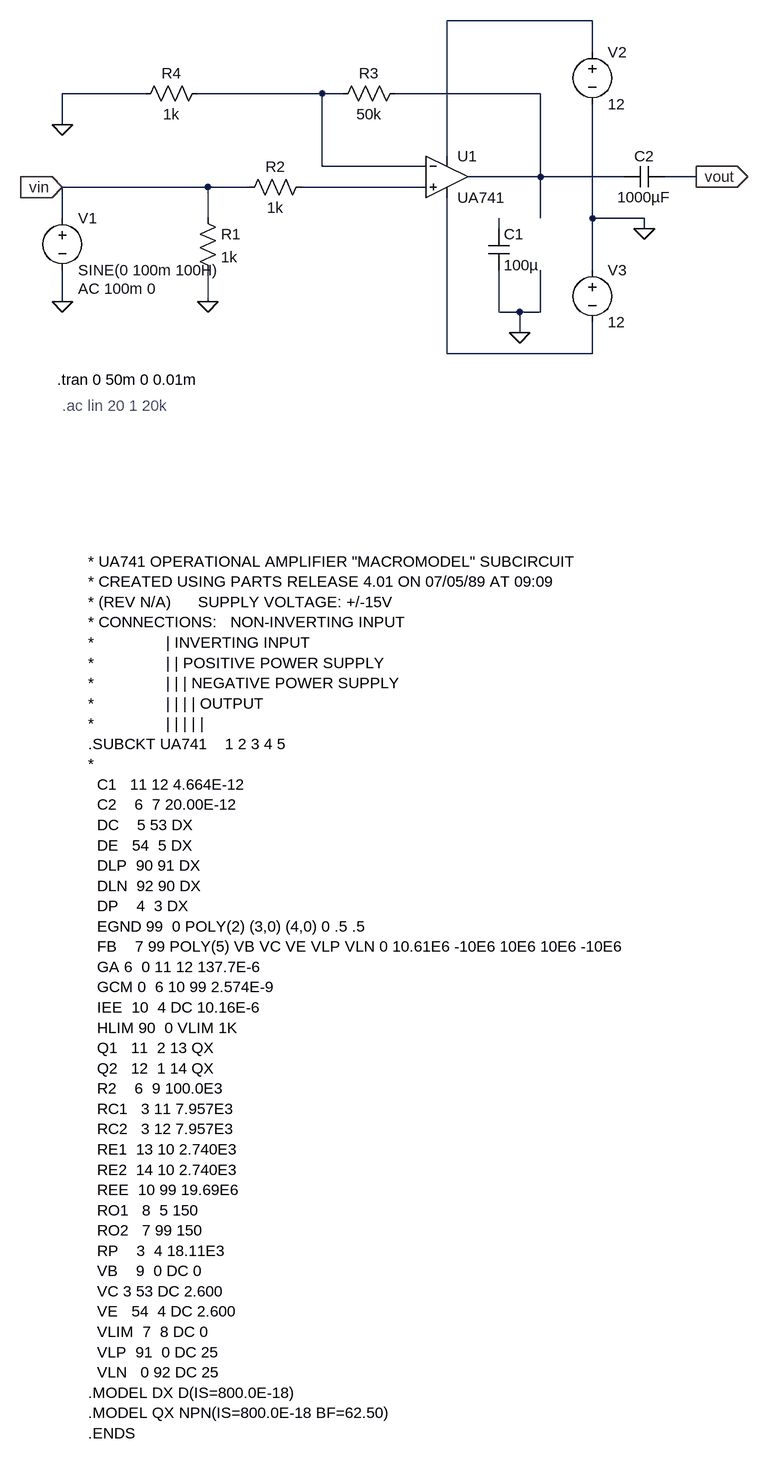
[diagram p0: schematic Speaker amplifier.asc]
Speaker amplifier.asc, the LTspice schematic file:
Version 4.1
SHEET 1 1136 1892
WIRE 864 -160 640 -160
WIRE 864 -112 864 -160
WIRE 176 -48 48 -48
WIRE 448 -48 256 -48
WIRE 480 -48 448 -48
WIRE 784 -48 560 -48
WIRE 48 0 48 -48
WIRE 640 48 640 -160
WIRE 448 64 448 -48
WIRE 608 64 448 64
WIRE 784 80 784 -48
WIRE 784 80 672 80
WIRE 912 80 784 80
WIRE 1024 80 976 80
WIRE 272 96 48 96
WIRE 336 96 272 96
WIRE 608 96 416 96
WIRE 48 144 48 96
WIRE 272 144 272 96
WIRE 784 144 784 80
WIRE 864 144 864 -32
WIRE 944 144 864 144
WIRE 720 160 720 144
WIRE 944 160 944 144
WIRE 864 224 864 144
WIRE 48 272 48 224
WIRE 272 272 272 224
WIRE 720 288 720 224
WIRE 752 288 720 288
WIRE 784 288 784 224
WIRE 784 288 752 288
WIRE 752 320 752 288
WIRE 640 352 640 112
WIRE 864 352 864 304
WIRE 864 352 640 352
FLAG 48 272 0
FLAG 272 272 0
FLAG 48 0 0
FLAG 944 160 0
FLAG 752 320 0
FLAG 48 96 vin
IOPIN 48 96 In
FLAG 1024 80 vout
IOPIN 1024 80 Out
SYMBOL voltage 48 128 R0
WINDOW 123 24 124 Left 2
WINDOW 39 0 0 Left 0
SYMATTR InstName V1
SYMATTR Value SINE(0 100m 100H)
SYMATTR Value2 AC 100m 0
SYMBOL res 256 128 R0
SYMATTR InstName R1
SYMATTR Value 1k
SYMBOL res 432 80 R90
WINDOW 0 0 56 VBottom 2
WINDOW 3 32 56 VTop 2
SYMATTR InstName R2
SYMATTR Value 1k
SYMBOL OpAmps\\opamp2 640 16 R0
SYMATTR InstName U1
SYMATTR Value UA741
SYMBOL res 576 -64 R90
WINDOW 0 0 56 VBottom 2
WINDOW 3 32 56 VTop 2
SYMATTR InstName R3
SYMATTR Value 50k
SYMBOL res 272 -64 R90
WINDOW 0 0 56 VBottom 2
WINDOW 3 32 56 VTop 2
SYMATTR InstName R4
SYMATTR Value 1k
SYMBOL voltage 864 -128 R0
WINDOW 123 0 0 Left 0
WINDOW 39 0 0 Left 0
SYMATTR InstName V2
SYMATTR Value 12
SYMBOL voltage 864 208 R0
WINDOW 123 0 0 Left 0
WINDOW 39 0 0 Left 0
SYMATTR InstName V3
SYMATTR Value 12
SYMBOL cap 704 160 R0
SYMATTR InstName C1
SYMATTR Value 100µ
SYMBOL cap 976 64 R90
WINDOW 0 0 32 VBottom 2
WINDOW 3 32 32 VTop 2
SYMATTR InstName C2
SYMATTR Value 1000µF
TEXT 88 672 Left 2 !* UA741 OPERATIONAL AMPLIFIER "MACROMODEL" SUBCIRCUIT\n* CREATED USING PARTS RELEASE 4.01 ON 07/05/89 AT 09:09\n* (REV N/A)      SUPPLY VOLTAGE: +/-15V\n* CONNECTIONS:   NON-INVERTING INPUT\n*                | INVERTING INPUT\n*                | | POSITIVE POWER SUPPLY\n*                | | | NEGATIVE POWER SUPPLY\n*                | | | | OUTPUT\n*                | | | | |\n.SUBCKT UA741    1 2 3 4 5\n*\n  C1   11 12 4.664E-12\n  C2    6  7 20.00E-12\n  DC    5 53 DX\n  DE   54  5 DX\n  DLP  90 91 DX\n  DLN  92 90 DX\n  DP    4  3 DX\n  EGND 99  0 POLY(2) (3,0) (4,0) 0 .5 .5\n  FB    7 99 POLY(5) VB VC VE VLP VLN 0 10.61E6 -10E6 10E6 10E6 -10E6\n  GA 6  0 11 12 137.7E-6\n  GCM 0  6 10 99 2.574E-9\n  IEE  10  4 DC 10.16E-6\n  HLIM 90  0 VLIM 1K\n  Q1   11  2 13 QX\n  Q2   12  1 14 QX\n  R2    6  9 100.0E3\n  RC1   3 11 7.957E3\n  RC2   3 12 7.957E3\n  RE1  13 10 2.740E3\n  RE2  14 10 2.740E3\n  REE  10 99 19.69E6\n  RO1   8  5 150\n  RO2   7 99 150\n  RP    3  4 18.11E3\n  VB    9  0 DC 0\n  VC 3 53 DC 2.600\n  VE   54  4 DC 2.600\n  VLIM  7  8 DC 0\n  VLP  91  0 DC 25\n  VLN   0 92 DC 25\n.MODEL DX D(IS=800.0E-18)\n.MODEL QX NPN(IS=800.0E-18 BF=62.50)\n.ENDS
TEXT 40 392 Left 2 !.tran 0 50m 0 0.01m
TEXT 48 432 Left 2 ;.ac lin 20 1 20k

The netlist it stands for:
* Speaker amplifier.asc
V1 vin 0 SINE(0 100m 100H) AC 100m 0
R1 vin 0 1k
R2 N004 vin 1k
X§U1 N004 N002 N001 N006 N003 UA741  ; pins In+ In- V+ V- OUT
R3 N003 N002 50k
R4 N002 0 1k
V2 N001 0 12
V3 0 N006 12
C1 N005 0 100µ
C2 vout N003 1000µF
* UA741 OPERATIONAL AMPLIFIER "MACROMODEL" SUBCIRCUIT
* CREATED USING PARTS RELEASE 4.01 ON 07/05/89 AT 09:09
* (REV N/A)      SUPPLY VOLTAGE: +/-15V
* CONNECTIONS:   NON-INVERTING INPUT
*                | INVERTING INPUT
*                | | POSITIVE POWER SUPPLY
*                | | | NEGATIVE POWER SUPPLY
*                | | | | OUTPUT
*                | | | | |
.SUBCKT UA741    1 2 3 4 5
*
  C1   11 12 4.664E-12
  C2    6  7 20.00E-12
  DC    5 53 DX
  DE   54  5 DX
  DLP  90 91 DX
  DLN  92 90 DX
  DP    4  3 DX
  EGND 99  0 POLY(2) (3,0) (4,0) 0 .5 .5
  FB    7 99 POLY(5) VB VC VE VLP VLN 0 10.61E6 -10E6 10E6 10E6 -10E6
  GA 6  0 11 12 137.7E-6
  GCM 0  6 10 99 2.574E-9
  IEE  10  4 DC 10.16E-6
  HLIM 90  0 VLIM 1K
  Q1   11  2 13 QX
  Q2   12  1 14 QX
  R2    6  9 100.0E3
  RC1   3 11 7.957E3
  RC2   3 12 7.957E3
  RE1  13 10 2.740E3
  RE2  14 10 2.740E3
  REE  10 99 19.69E6
  RO1   8  5 150
  RO2   7 99 150
  RP    3  4 18.11E3
  VB    9  0 DC 0
  VC 3 53 DC 2.600
  VE   54  4 DC 2.600
  VLIM  7  8 DC 0
  VLP  91  0 DC 25
  VLN   0 92 DC 25
.MODEL DX D(IS=800.0E-18)
.MODEL QX NPN(IS=800.0E-18 BF=62.50)
.ENDS
.tran 0 50m 0 0.01m
* .ac lin 20 1 20k
.backanno
.end